# Altium project embedded-dev-26.PrjPcb
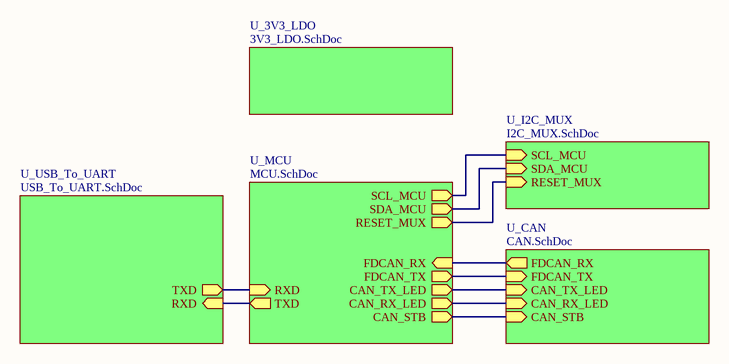
[diagram p0: TLD.SchDoc]
6 sheets, 115 parts. Net scope: hierarchical (ports join the sheet entries above them; power ports are global).
Board file: embedded-dev-26.PcbDoc
Sheets:
  TLD.SchDoc
    U_3V3_LDO = 3V3_LDO.SchDoc
    U_CAN = CAN.SchDoc
    U_I2C_MUX = I2C_MUX.SchDoc
    U_MCU = MCU.SchDoc
    U_USB_To_UART = USB_To_UART.SchDoc

## Sheet TLD.SchDoc
size A; SheetNumber: 1; SheetTotal: 5

### Sub-sheets
U_3V3_LDO = 3V3_LDO.SchDoc: no entries
U_CAN = CAN.SchDoc: FDCAN_RX (out), FDCAN_TX (in), CAN_TX_LED (in), CAN_RX_LED (in), CAN_STB (in)
U_I2C_MUX = I2C_MUX.SchDoc: SCL_MCU (in), SDA_MCU (in), RESET_MUX (in)
U_MCU = MCU.SchDoc: SCL_MCU (out), SDA_MCU (out), FDCAN_RX (in), FDCAN_TX (out), CAN_RX_LED (out), CAN_TX_LED (out), RESET_MUX (out), TXD (out), RXD (in), CAN_STB (out)
U_USB_To_UART = USB_To_UART.SchDoc: TXD (out), RXD (in)

### Nets
CAN_RX_LED: sheet U_CAN/CAN_RX_LED, sheet U_MCU/CAN_RX_LED
CAN_STB: sheet U_CAN/CAN_STB, sheet U_MCU/CAN_STB
CAN_TX_LED: sheet U_CAN/CAN_TX_LED, sheet U_MCU/CAN_TX_LED
FDCAN_RX: sheet U_CAN/FDCAN_RX, sheet U_MCU/FDCAN_RX
FDCAN_TX: sheet U_CAN/FDCAN_TX, sheet U_MCU/FDCAN_TX
RESET_MUX: sheet U_I2C_MUX/RESET_MUX, sheet U_MCU/RESET_MUX
RXD: sheet U_MCU/RXD, sheet U_USB_To_UART/TXD
SCL_MCU: sheet U_I2C_MUX/SCL_MCU, sheet U_MCU/SCL_MCU
SDA_MCU: sheet U_I2C_MUX/SDA_MCU, sheet U_MCU/SDA_MCU
TXD: sheet U_MCU/TXD, sheet U_USB_To_UART/RXD

## Sheet 3V3_LDO.SchDoc
size A; SheetNumber: 6; SheetTotal: 6
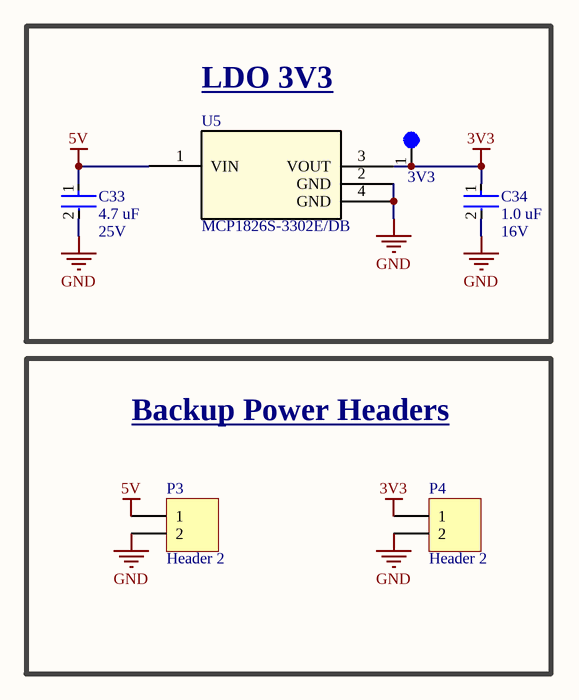
[diagram p1: 3V3_LDO.SchDoc]

### Parts
3V3  5003  [TEST-POINT-0001]  (value not drawn)
C33  Capacitance: 4.7 uF  Voltage: 25V  [CAP-0603]  (hidden comment: CC0603KRX5R8BB475)
C34  Capacitance: 1.0 uF  Voltage: 16V  [CAP-0603]  (hidden comment: CC0603KRX7R7BB105)
P3  Header 2  [HDR1X2]
P4  Header 2  [HDR1X2]
U5  MCP1826S-3302E/DB  [SOT-223_3MC_MCH]

### Blocks framed on the sheet
LDO 3V3: 3V3 C33 C34 U5
Backup Power Headers: P3 P4

### Nets
3V3: 3V3.1 C34.1 P4.1 U5.3(VOUT)
5V: C33.1 P3.1 U5.1(VIN)
GND: C33.2 C34.2 P3.2 P4.2 U5.2(GND) U5.4(GND)

### Library data of the parts
3V3 = TEST-POINT-0001: Oranange PC Test Point, Miniature Phoisphor Bronze Silver Plating Through Hole Mounting Type
C33 = CAP-4.7U-0001: CAP CER 4.7UF 25V X5R 0603; Device Class: Ceramic; Size: 0603
C34 = CAP-1U-0002: CAP CER 1UF 16V X7R 0603; Device Class: Ceramic; Size: 0603
P3 P4 = Header 2: Header, 2-Pin; LatestRevisionDate: 17-Jul-2002; LatestRevisionNote: Re-released for DXP Platform.; Publisher: Altium Limited
U5 = IC-LDO-0003: Linear Voltage Regulator IC Positive Fixed 1 Output 1A SOT-223-3; Manufacturer_Name: Microchip; Copyright: Copyright (C) 2025 Ultra Librarian. All rights reserved.; Manufacturer_Part_Number: MCP1826S-3302E/DB; RefDes: RefDes; Type: Type; ComponentLink1Description: Datasheet; ComponentLink1URL: https://ww1.microchip.com/downloads/en/DeviceDoc/22057B.pdf

## Sheet CAN.SchDoc
size A; SheetNumber: 6; SheetTotal: 6
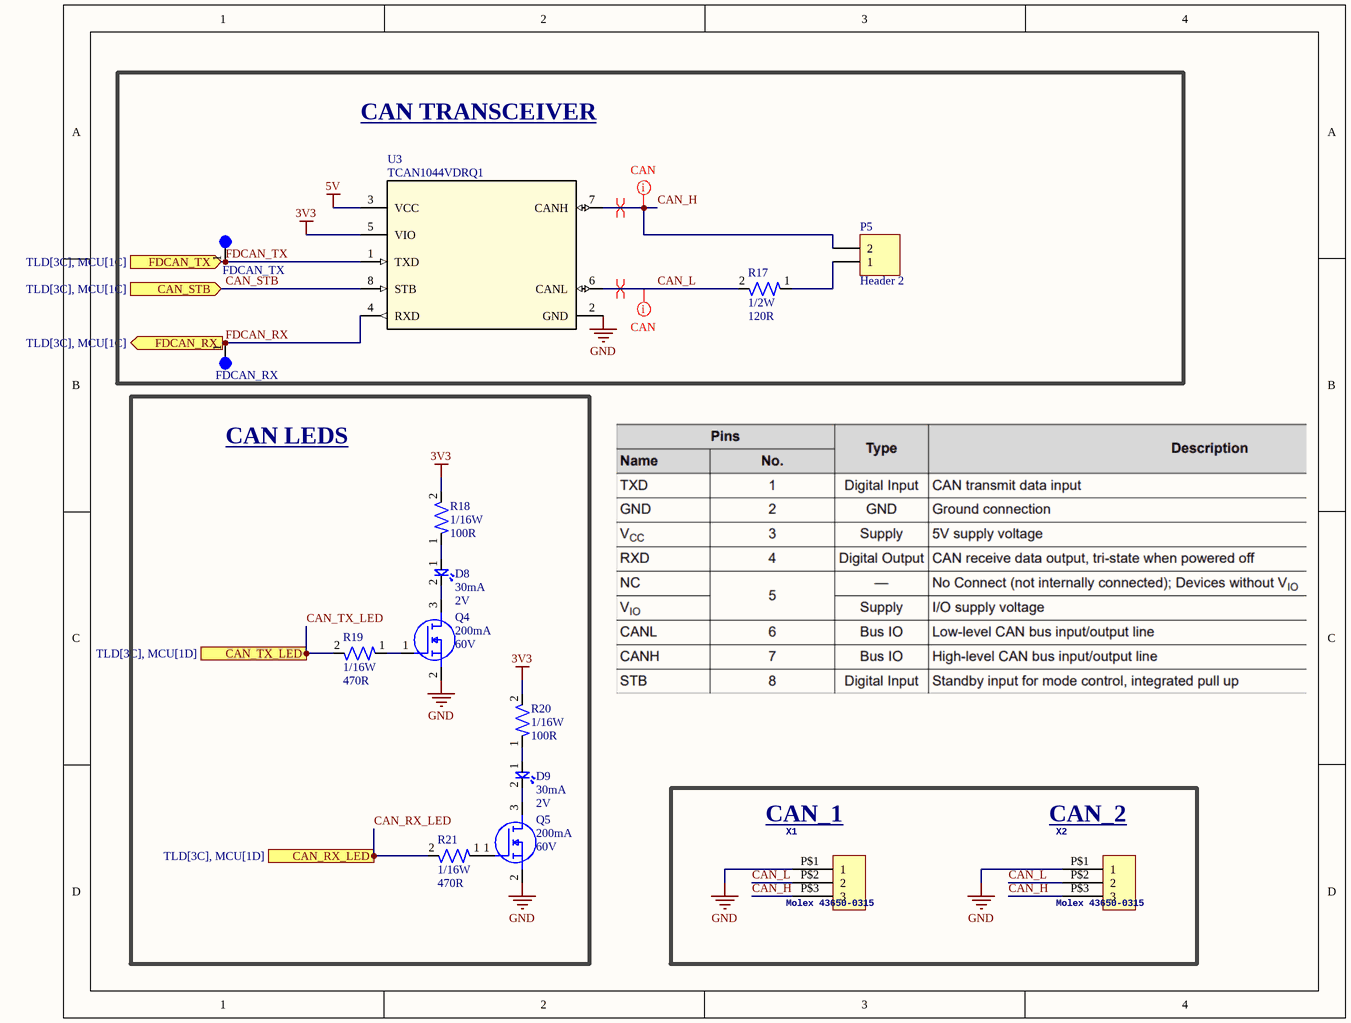
[diagram p2: CAN.SchDoc]

### Parts
D8  Forward Current: 30mA  Forward Voltage: 2V  [LED-0603]  (hidden comment: BL-HKC36G-AV-TRB)
D9  Forward Current: 30mA  Forward Voltage: 2V  [LED-0603]  (hidden comment: BL-HKC36G-AV-TRB)
FDCAN_RX  5003  [TEST-POINT-0001]  (value not drawn)
FDCAN_TX  5003  [TEST-POINT-0001]  (value not drawn)
P5  Header 2  [HDR1X2]
Q4  Continuous Current: 200mA  Voltage: 60V  [IC-SOT23-3]  (hidden comment: T2N7002AK,LM)
Q5  Continuous Current: 200mA  Voltage: 60V  [IC-SOT23-3]  (hidden comment: T2N7002AK,LM)
R17  Power: 1/2W  Resistance: 120R  [RES-1210]  (hidden comment: RC1210FR-07120RL)
R18  Power: 1/16W  Resistance: 100R  [RES-0402]  (hidden comment: RC0402FR-07100RL)
R19  Power: 1/16W  Resistance: 470R  [RES-0402]  (hidden comment: RC0402FR-07470RL)
R20  Power: 1/16W  Resistance: 100R  [RES-0402]  (hidden comment: RC0402FR-07100RL)
R21  Power: 1/16W  Resistance: 470R  [RES-0402]  (hidden comment: RC0402FR-07470RL)
U3  TCAN1044VDRQ1  [IC-8SOIC]
X1  Molex 43650-0315  [43650-0315]
X2  Molex 43650-0315  [43650-0315]

### Blocks framed on the sheet
CAN TRANSCEIVER: FDCAN_RX FDCAN_TX P5 R17 U3
CAN LEDS: D8 D9 Q4 Q5 R18-R21

### Ports
CAN_RX_LED (in, see TLD[3C], MCU[1D]), CAN_STB (in, see TLD[3C], MCU[1C]), CAN_TX_LED (in, see TLD[3C], MCU[1D]), FDCAN_RX (out, see TLD[3C], MCU[1C]), FDCAN_TX (in, see TLD[3C], MCU[1C])

### Nets
3V3: R18.2 R20.2 U3.5(VIO)
5V: U3.3(VCC)
GND: Q4.2(S) Q5.2(S) U3.2(GND) X1.P$1(1) X2.P$1(1)
CAN_H: P5.2 U3.7(CANH) X1.P$3(3) X2.P$3(3)
CAN_L: R17.2 U3.6(CANL) X1.P$2(2) X2.P$2(2)
CAN_RX_LED: R21.2 ; port CAN_RX_LED
CAN_STB: U3.8(STB) ; port CAN_STB
CAN_TX_LED: R19.2 ; port CAN_TX_LED
FDCAN_RX: FDCAN_RX.1 U3.4(RXD) ; port FDCAN_RX
FDCAN_TX: FDCAN_TX.1 U3.1(TXD) ; port FDCAN_TX
NetD8_1: D8.1 R18.1
NetD8_2: D8.2 Q4.3(D)
NetD9_1: D9.1 R20.1
NetD9_2: D9.2 Q5.3(D)
NetP5_1: P5.1 R17.1
NetQ4_1: Q4.1(G) R19.1
NetQ5_1: Q5.1(G) R21.1

### Layout directives
differential pair; differential pair class CAN: CAN_H, CAN_L
mark named CAN: CAN_H, CAN_L

### Notes on the sheet
- (near X1) CAN_1
- (near X2) CAN_2

### Library data of the parts
D8 D9 = LED-0001: LED YELLOW CLEAR 0603 SMD; ComponentLink1Description: Datasheet; ComponentLink1URL: https://www.americanbrightled.com/pdffiles/led-components/smt/BL-HKC36G-AV-TRB.pdf
FDCAN_RX FDCAN_TX = TEST-POINT-0001: as 3V3 on sheet 3V3_LDO
P5 = Header 2: Header, 2-Pin; LatestRevisionDate: 17-Jul-2002; LatestRevisionNote: Re-released for DXP Platform.; Publisher: Altium Limited
Q4 Q5 = NMOS-200MA-0001: MOSFET N-CH 60V 200MA SOT23; ComponentLink1Description: Datasheet; ComponentLink1URL: https://toshiba.semicon-storage.com/info/T2N7002AK_datasheet_en_20150401.pdf?did=29712&prodName=T2N7002AK
R17 = RES-120-0001: RES 120 OHM 1% 1/2W 1210; Tolerance: 1%; Size: 1210; ComponentLink1Description: Datasheet; ComponentLink1URL: https://www.yageo.com/upload/media/product/products/datasheet/rchip/PYu-RC_Group_51_RoHS_L_12.pdf
R18 R20 = RES-100-0001: RES 100 OHM 1% 1/16W 0402; Tolerance: 1%; Size: 0402; ComponentLink1Description: Datasheet; ComponentLink1URL: https://www.yageo.com/upload/media/product/products/datasheet/rchip/PYu-RC_Group_51_RoHS_L_12.pdf
R19 R21 = RES-470-0001: RES 470 OHM 1% 1/16W 0402; Tolerance: 1%; Size: 0402; ComponentLink1Description: Datasheet; ComponentLink1URL: https://www.yageo.com/upload/media/product/products/datasheet/rchip/PYu-RC_Group_51_RoHS_L_12.pdf
U3 = IC-CAN-0001: IC TRANSCEIVER 1/1 8SOIC; ComponentLink1Description: Datasheet; ComponentLink1URL: https://www.ti.com/lit/ds/symlink/tcan1044-q1.pdf?HQS=dis-dk-null-digikeymode-dsf-pf-null-wwe&ts=1728758303289&ref_url=https%253A%252F%252Fwww.ti.com%252Fgeneral%252Fdocs%252Fsuppproductinfo.tsp%253FdistId%253D10%2526gotoUrl%253Dhttps%253A%252F%252Fwww.ti.com%252Flit%252Fgpn%252Ftcan1044-q1
X1 X2 = Micro-Fit Molex 3 Pin Vertical: GateName_1: G$1; SymbolName_1: HEADER_POS3; DeviceSetName: HEADER_POS3_?; DeviceName: 43650-0315; LibraryName: con-molex-micro-fit-3_0_2; Package: 43650-0315

## Sheet I2C_MUX.SchDoc
size A; SheetNumber: 4; SheetTotal: 6
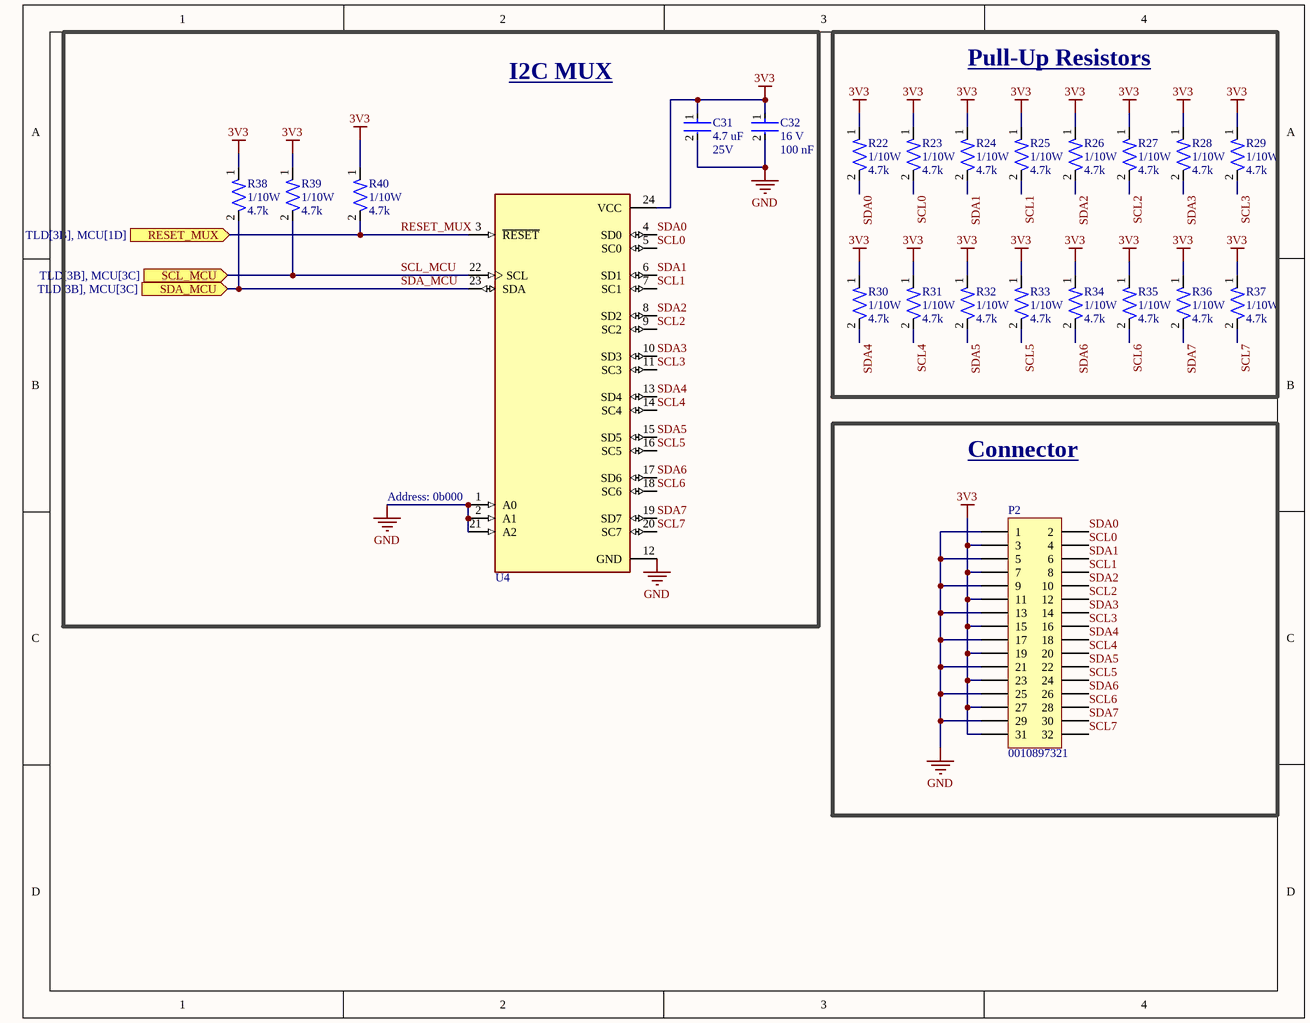
[diagram p3: I2C_MUX.SchDoc]

### Parts
C31  Capacitance: 4.7 uF  Voltage: 25V  [CAP-0603]  (hidden comment: CC0603KRX5R8BB475)
C32  Voltage Rating: 16 V  Capacitance: 100 nF  [CAP-0402]  (hidden comment: CC0402KRX7R7BB104)
P2  0010897321  [HDR2X16]
R22  Power: 1/10W  Resistance: 4.7k  [RES-0603]  (hidden comment: RC0603FR-074K7L)
R23  Power: 1/10W  Resistance: 4.7k  [RES-0603]  (hidden comment: RC0603FR-074K7L)
R24  Power: 1/10W  Resistance: 4.7k  [RES-0603]  (hidden comment: RC0603FR-074K7L)
R25  Power: 1/10W  Resistance: 4.7k  [RES-0603]  (hidden comment: RC0603FR-074K7L)
R26  Power: 1/10W  Resistance: 4.7k  [RES-0603]  (hidden comment: RC0603FR-074K7L)
R27  Power: 1/10W  Resistance: 4.7k  [RES-0603]  (hidden comment: RC0603FR-074K7L)
R28  Power: 1/10W  Resistance: 4.7k  [RES-0603]  (hidden comment: RC0603FR-074K7L)
R29  Power: 1/10W  Resistance: 4.7k  [RES-0603]  (hidden comment: RC0603FR-074K7L)
R30  Power: 1/10W  Resistance: 4.7k  [RES-0603]  (hidden comment: RC0603FR-074K7L)
R31  Power: 1/10W  Resistance: 4.7k  [RES-0603]  (hidden comment: RC0603FR-074K7L)
R32  Power: 1/10W  Resistance: 4.7k  [RES-0603]  (hidden comment: RC0603FR-074K7L)
R33  Power: 1/10W  Resistance: 4.7k  [RES-0603]  (hidden comment: RC0603FR-074K7L)
R34  Power: 1/10W  Resistance: 4.7k  [RES-0603]  (hidden comment: RC0603FR-074K7L)
R35  Power: 1/10W  Resistance: 4.7k  [RES-0603]  (hidden comment: RC0603FR-074K7L)
R36  Power: 1/10W  Resistance: 4.7k  [RES-0603]  (hidden comment: RC0603FR-074K7L)
R37  Power: 1/10W  Resistance: 4.7k  [RES-0603]  (hidden comment: RC0603FR-074K7L)
R38  Power: 1/10W  Resistance: 4.7k  [RES-0603]  (hidden comment: RC0603FR-074K7L)
R39  Power: 1/10W  Resistance: 4.7k  [RES-0603]  (hidden comment: RC0603FR-074K7L)
R40  Power: 1/10W  Resistance: 4.7k  [RES-0603]  (hidden comment: RC0603FR-074K7L)
U4  TCA9548APWR  [SOP65P640X120-24N]  (value not drawn)

### Blocks framed on the sheet
I2C MUX: C31 C32 R38-R40 U4
Pull-Up Resistors: R22-R37
Connector: P2

### Ports
RESET_MUX (in, see TLD[3B], MCU[1D]), SCL_MCU (in, see TLD[3B], MCU[3C]), SDA_MCU (in, see TLD[3B], MCU[3C])

### Nets
3V3: C31.1 C32.1 P2.3 P2.7 P2.11 P2.15 P2.19 P2.23 P2.27 P2.31 R22.1 R23.1 R24.1 R25.1 R26.1 R27.1 R28.1 R29.1 R30.1 R31.1 R32.1 R33.1 R34.1 R35.1 R36.1 R37.1 R38.1 R39.1 R40.1 U4.24(VCC)
GND: C31.2 C32.2 P2.1 P2.5 P2.9 P2.13 P2.17 P2.21 P2.25 P2.29 U4.1(A0) U4.2(A1) U4.12(GND) U4.21(A2)
RESET_MUX: R40.2 U4.3(~{RESET}) ; port RESET_MUX
SCL0: P2.4 R23.2 U4.5(SC0)
SCL1: P2.8 R25.2 U4.7(SC1)
SCL2: P2.12 R27.2 U4.9(SC2)
SCL3: P2.16 R29.2 U4.11(SC3)
SCL4: P2.20 R31.2 U4.14(SC4)
SCL5: P2.24 R33.2 U4.16(SC5)
SCL6: P2.28 R35.2 U4.18(SC6)
SCL7: P2.32 R37.2 U4.20(SC7)
SCL_MCU: R39.2 U4.22(SCL) ; port SCL_MCU
SDA0: P2.2 R22.2 U4.4(SD0)
SDA1: P2.6 R24.2 U4.6(SD1)
SDA2: P2.10 R26.2 U4.8(SD2)
SDA3: P2.14 R28.2 U4.10(SD3)
SDA4: P2.18 R30.2 U4.13(SD4)
SDA5: P2.22 R32.2 U4.15(SD5)
SDA6: P2.26 R34.2 U4.17(SD6)
SDA7: P2.30 R36.2 U4.19(SD7)
SDA_MCU: R38.2 U4.23(SDA) ; port SDA_MCU

### Notes on the sheet
- (near U4) Address: 0b000

### Library data of the parts
C31 = CAP-4.7U-0001: CAP CER 4.7UF 25V X5R 0603; Device Class: Ceramic; Size: 0603
C32 = CAP-0.1U-0001: CAP CER 0.1UF 16V X7R 0402; ComponentLink2Description: Datasheet; ComponentLink2URL: https://www.yageo.com/upload/media/product/productsearch/datasheet/mlcc/UPY-GPHC_X7R_6.3V-to-250V_24.pdf; Device Class: Ceramic; Size: 0402
P2 = Header 16X2: Header, 16-Pin, Dual row; LatestRevisionDate: 17-Jul-2002; LatestRevisionNote: Re-released for DXP Platform.; Publisher: Altium Limited
R22-R40 = RES-4.7k-0001: RES 4.7K OHM 1% 1/10W 0603; Tolerance: 1%; Size: 0603; ComponentLink1Description: Datasheet; ComponentLink1URL: https://www.yageo.com/upload/media/product/products/datasheet/rchip/PYu-RC_Group_51_RoHS_L_12.pdf
U4 = IC-MUX-0002: 8-channel 1.65- to 5.5-V I2C/SMBus switch with reset & voltage translation; MF: Texas Instruments; SnapEDA_Link: https://www.snapeda.com/parts/TCA9548APWR/Texas+Instruments/view-part/?ref=snap; Package: TSSOP-24 Texas Instruments; Value: *; MP: TCA9548APWR; Check_prices: https://www.snapeda.com/parts/TCA9548APWR/Texas+Instruments/view-part/?ref=eda; ComponentLink1Description: Datasheet; ComponentLink1URL: https://www.ti.com/general/docs/suppproductinfo.tsp?distId=10&gotoUrl=https%3A%2F%2Fwww.ti.com%2Flit%2Fgpn%2Ftca9548a

## Sheet MCU.SchDoc
size A; SheetNumber: 2; SheetTotal: 5
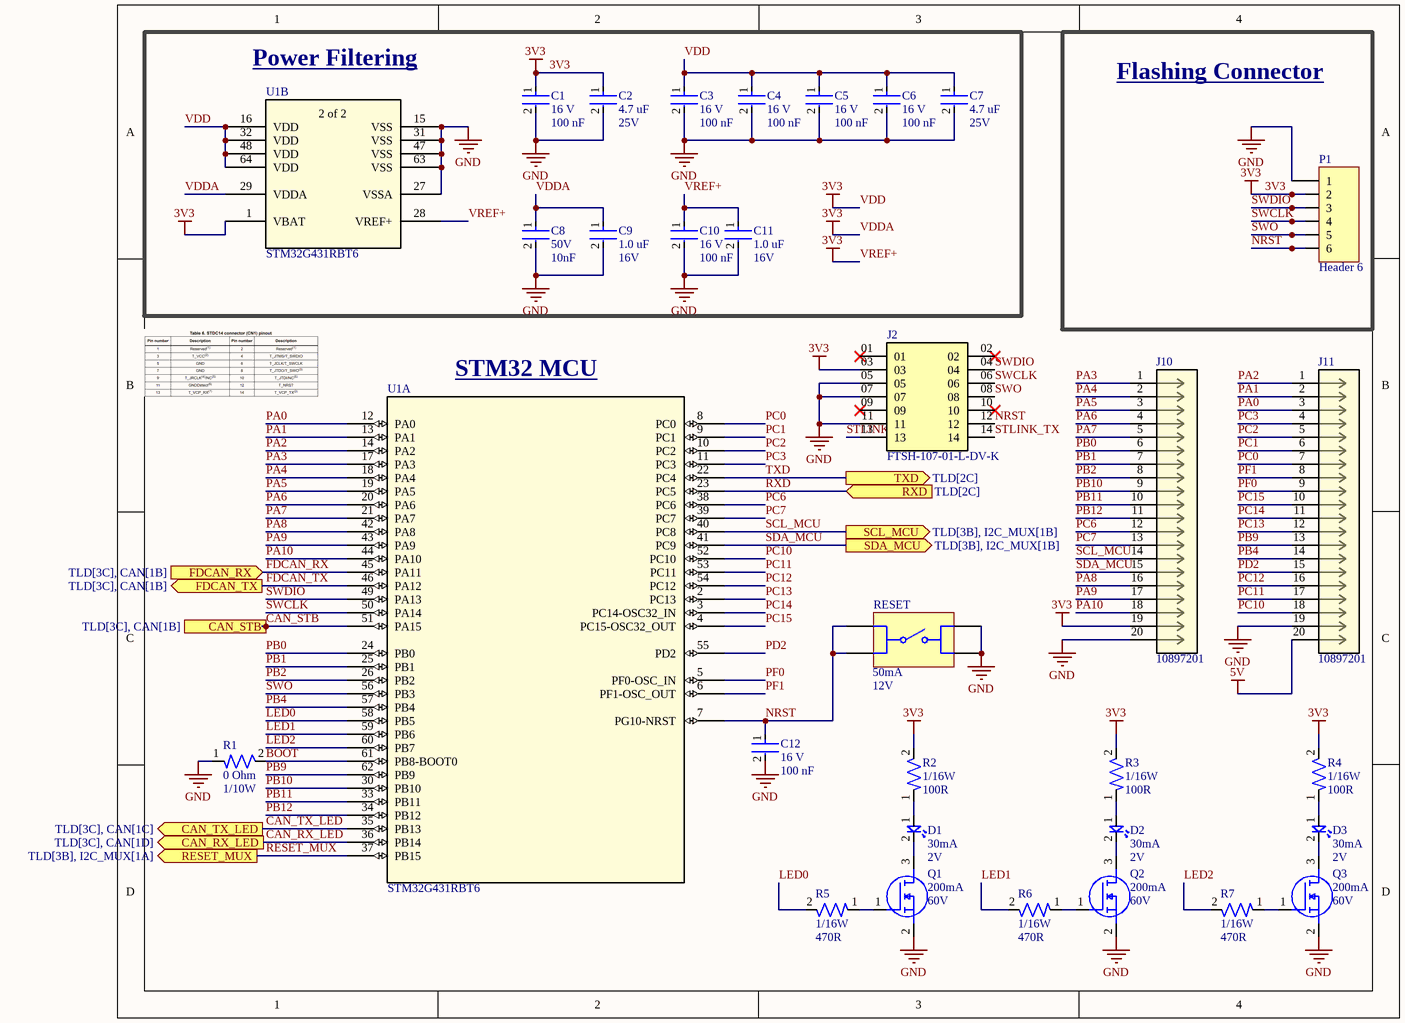
[diagram p4: MCU.SchDoc]

### Parts
C1  Voltage Rating: 16 V  Capacitance: 100 nF  [CAP-0402]  (hidden comment: CC0402KRX7R7BB104)
C2  Capacitance: 4.7 uF  Voltage: 25V  [CAP-0603]  (hidden comment: CC0603KRX5R8BB475)
C3  Voltage Rating: 16 V  Capacitance: 100 nF  [CAP-0402]  (hidden comment: CC0402KRX7R7BB104)
C4  Voltage Rating: 16 V  Capacitance: 100 nF  [CAP-0402]  (hidden comment: CC0402KRX7R7BB104)
C5  Voltage Rating: 16 V  Capacitance: 100 nF  [CAP-0402]  (hidden comment: CC0402KRX7R7BB104)
C6  Voltage Rating: 16 V  Capacitance: 100 nF  [CAP-0402]  (hidden comment: CC0402KRX7R7BB104)
C7  Capacitance: 4.7 uF  Voltage: 25V  [CAP-0603]  (hidden comment: CC0603KRX5R8BB475)
C8  Voltage: 50V  Capacitance: 10nF  [CAP-0805]  (hidden comment: GRM2195C1H103JA01D)
C9  Capacitance: 1.0 uF  Voltage: 16V  [CAP-0603]  (hidden comment: CC0603KRX7R7BB105)
C10  Voltage Rating: 16 V  Capacitance: 100 nF  [CAP-0402]  (hidden comment: CC0402KRX7R7BB104)
C11  Capacitance: 1.0 uF  Voltage: 16V  [CAP-0603]  (hidden comment: CC0603KRX7R7BB105)
C12  Voltage Rating: 16 V  Capacitance: 100 nF  [CAP-0402]  (hidden comment: CC0402KRX7R7BB104)
D1  Forward Current: 30mA  Forward Voltage: 2V  [LED-0603]  (hidden comment: BL-HKC36G-AV-TRB)
D2  Forward Current: 30mA  Forward Voltage: 2V  [LED-0603]  (hidden comment: BL-HKC36G-AV-TRB)
D3  Forward Current: 30mA  Forward Voltage: 2V  [LED-0603]  (hidden comment: BL-HKC36G-AV-TRB)
J2  FTSH-107-01-L-DV-K  [SAMTEC_FTSH-107-01-L-DV-K]
J10  10897201  [CONN20_0010897201_MOL]
J11  10897201  [CONN20_0010897201_MOL]
P1  Header 6  [HDR1X6]
Q1  Continuous Current: 200mA  Voltage: 60V  [IC-SOT23-3]  (hidden comment: T2N7002AK,LM)
Q2  Continuous Current: 200mA  Voltage: 60V  [IC-SOT23-3]  (hidden comment: T2N7002AK,LM)
Q3  Continuous Current: 200mA  Voltage: 60V  [IC-SOT23-3]  (hidden comment: T2N7002AK,LM)
R1  Resistance: 0 Ohm  Power: 1/10W  [RESC1607X60N]  (hidden comment: RESC1607X60N)
R2  Power: 1/16W  Resistance: 100R  [RES-0402]  (hidden comment: RC0402FR-07100RL)
R3  Power: 1/16W  Resistance: 100R  [RES-0402]  (hidden comment: RC0402FR-07100RL)
R4  Power: 1/16W  Resistance: 100R  [RES-0402]  (hidden comment: RC0402FR-07100RL)
R5  Power: 1/16W  Resistance: 470R  [RES-0402]  (hidden comment: RC0402FR-07470RL)
R6  Power: 1/16W  Resistance: 470R  [RES-0402]  (hidden comment: RC0402FR-07470RL)
R7  Power: 1/16W  Resistance: 470R  [RES-0402]  (hidden comment: RC0402FR-07470RL)
RESET  Rated Current: 50mA  Rated Voltage (DC): 12V  [430182095816]  (hidden comment: 430182095816)
U1  STM32G431RBT6  [LQFP64-10x10mm]  (parts A,B of 2)

### Blocks framed on the sheet
Power Filtering: C1-C11 U1
Flashing Connector: P1

### Ports
CAN_RX_LED (out, see TLD[3C], CAN[1D]), CAN_STB (out, see TLD[3C], CAN[1B]), CAN_TX_LED (out, see TLD[3C], CAN[1C]), FDCAN_RX (in, see TLD[3C], CAN[1B]), FDCAN_TX (out, see TLD[3C], CAN[1B]), RESET_MUX (out, see TLD[3B], I2C_MUX[1A]), RXD (in, see TLD[2C]), SCL_MCU (out, see TLD[3B], I2C_MUX[1B]), SDA_MCU (out, see TLD[3B], I2C_MUX[1B]), TXD (out, see TLD[2C])

### Nets
3V3: C1.1 C2.1 C3.1 C4.1 C5.1 C6.1 C7.1 C8.1 C9.1 C10.1 C11.1 J2.03 J10.19 P1.2 R2.2 R3.2 R4.2 U1.1(VBAT) U1.16(VDD) U1.28(VREF+) U1.29(VDDA) U1.32(VDD) U1.48(VDD) U1.64(VDD)  [also labelled VDD, VDDA, VREF+]
5V: J11.20
GND: C1.2 C2.2 C3.2 C4.2 C5.2 C6.2 C7.2 C8.2 C9.2 C10.2 C11.2 C12.2 J2.05 J2.07 J2.11 J10.20 J11.19 P1.1 Q1.2(S) Q2.2(S) Q3.2(S) R1.1 RESET.B1 RESET.B2 U1.15(VSS) U1.27(VSSA) U1.31(VSS) U1.47(VSS) U1.63(VSS)
BOOT: R1.2 U1.61(PB8-BOOT0)
CAN_RX_LED: U1.36(PB14) ; port CAN_RX_LED
CAN_STB: U1.51(PA15) ; port CAN_STB
CAN_TX_LED: U1.35(PB13) ; port CAN_TX_LED
FDCAN_RX: U1.45(PA11) ; port FDCAN_RX
FDCAN_TX: U1.46(PA12) ; port FDCAN_TX
LED0: R5.2 U1.58(PB5)
LED1: R6.2 U1.59(PB6)
LED2: R7.2 U1.60(PB7)
NRST: C12.1 J2.12 P1.6 RESET.A1 RESET.A2 U1.7(PG10-NRST)
PA0: J11.3 U1.12(PA0)
PA1: J11.2 U1.13(PA1)
PA2: J11.1 U1.14(PA2)
PA3: J10.1 U1.17(PA3)
PA4: J10.2 U1.18(PA4)
PA5: J10.3 U1.19(PA5)
PA6: J10.4 U1.20(PA6)
PA7: J10.5 U1.21(PA7)
PA8: J10.16 U1.42(PA8)
PA9: J10.17 U1.43(PA9)
PA10: J10.18 U1.44(PA10)
PB0: J10.6 U1.24(PB0)
PB1: J10.7 U1.25(PB1)
PB2: J10.8 U1.26(PB2)
PB4: J11.14 U1.57(PB4)
PB9: J11.13 U1.62(PB9)
PB10: J10.9 U1.30(PB10)
PB11: J10.10 U1.33(PB11)
PB12: J10.11 U1.34(PB12)
PC0: J11.7 U1.8(PC0)
PC1: J11.6 U1.9(PC1)
PC2: J11.5 U1.10(PC2)
PC3: J11.4 U1.11(PC3)
PC6: J10.12 U1.38(PC6)
PC7: J10.13 U1.39(PC7)
PC10: J11.18 U1.52(PC10)
PC11: J11.17 U1.53(PC11)
PC12: J11.16 U1.54(PC12)
PC13: J11.12 U1.2(PC13)
PC14: J11.11 U1.3(PC14-OSC32_IN)
PC15: J11.10 U1.4(PC15-OSC32_OUT)
PD2: J11.15 U1.55(PD2)
PF0: J11.9 U1.5(PF0-OSC_IN)
PF1: J11.8 U1.6(PF1-OSC_OUT)
RESET_MUX: U1.37(PB15) ; port RESET_MUX
RXD: U1.23(PC5) ; port RXD
SCL_MCU: J10.14 U1.40(PC8) ; port SCL_MCU
SDA_MCU: J10.15 U1.41(PC9) ; port SDA_MCU
STLINK_RX: J2.13
STLINK_TX: J2.14
SWCLK: J2.06 P1.4 U1.50(PA14)
SWDIO: J2.04 P1.3 U1.49(PA13)
SWO: J2.08 P1.5 U1.56(PB3)
TXD: U1.22(PC4) ; port TXD
NetD1_1: D1.1 R2.1
NetD1_2: D1.2 Q1.3(D)
NetD2_1: D2.1 R3.1
NetD2_2: D2.2 Q2.3(D)
NetD3_1: D3.1 R4.1
NetD3_2: D3.2 Q3.3(D)
NetQ1_1: Q1.1(G) R5.1
NetQ2_1: Q2.1(G) R6.1
NetQ3_1: Q3.1(G) R7.1

Not connected (* = marked no-connect by the designer): J2 01* 02* 09* 10*

### Notes on the sheet
- (near U1) STM32 MCU
- (in symbol IC-STM32G431RBT6, part B) 2 of 2

### Library data of the parts
C1 C3-C6 C10 C12 = CAP-0.1U-0001: CAP CER 0.1UF 16V X7R 0402; ComponentLink2Description: Datasheet; ComponentLink2URL: https://www.yageo.com/upload/media/product/productsearch/datasheet/mlcc/UPY-GPHC_X7R_6.3V-to-250V_24.pdf; Device Class: Ceramic; Size: 0402
C2 C7 = CAP-4.7U-0001: CAP CER 4.7UF 25V X5R 0603; Device Class: Ceramic; Size: 0603
C8 = CAP-10N-0001: CAP CER 10000PF 50V C0G/NP0 0805; Device Class: Ceramic; Size: 0805; ComponentLink1Description: Datasheet; ComponentLink1URL: https://search.murata.co.jp/Ceramy/image/img/A01X/G101/ENG/GRM2195C1H103JA01-01.pdf
C9 C11 = CAP-1U-0002: CAP CER 1UF 16V X7R 0603; Device Class: Ceramic; Size: 0603
D1-D3 = LED-0001: LED YELLOW CLEAR 0603 SMD; ComponentLink1Description: Datasheet; ComponentLink1URL: https://www.americanbrightled.com/pdffiles/led-components/smt/BL-HKC36G-AV-TRB.pdf
J2 = CONN_Flashing-0001: Connector Header Surface Mount 14 position 0.050" (1.27mm); MF: Samtec; Value: *; Price: None; Package: None; Availability: Unavailable; MP: FTSH-107-01-L-DV-K; ComponentLink1Description: Datasheet; ComponentLink1URL: https://mm.digikey.com/Volume0/opasdata/d220001/medias/docus/6209/ftsh-1xx-xx-xxx-dv-xxx-xxx-x-xx-mkt.pdf
J10 J11 = CONN-20: 2.54mm Pitch C-Grid Breakaway Header, Dual Row, Vertical, High Temperature, 20 Circuits, Tin (Sn) Plating, 2.72mm PC Tail Length; Manufacturer_Name: Molex Connector Corporation; Copyright: Copyright (C) 2025 Ultra Librarian. All rights reserved.; Manufacturer_Part_Number: 10897201; Datasheet: https://www.molex.com/en-us/products/part-detail-pdf/10897201?display=pdf; RefDes: RefDes; Type: Type
P1 = Header 6: Header, 6-Pin; LatestRevisionDate: 17-Jul-2002; LatestRevisionNote: Re-released for DXP Platform.; Publisher: Altium Limited
Q1-Q3 = NMOS-200MA-0001: MOSFET N-CH 60V 200MA SOT23; ComponentLink1Description: Datasheet; ComponentLink1URL: https://toshiba.semicon-storage.com/info/T2N7002AK_datasheet_en_20150401.pdf?did=29712&prodName=T2N7002AK
R1 = RES-0-0003: 0 Ohms Jumper Chip Resistor 0603 (1608 Metric) Moisture Resistant Thick Film; assembled?: yes; JLC part number: C106231
R2-R4 = RES-100-0001: RES 100 OHM 1% 1/16W 0402; Tolerance: 1%; Size: 0402; ComponentLink1Description: Datasheet; ComponentLink1URL: https://www.yageo.com/upload/media/product/products/datasheet/rchip/PYu-RC_Group_51_RoHS_L_12.pdf
R5-R7 = RES-470-0001: RES 470 OHM 1% 1/16W 0402; Tolerance: 1%; Size: 0402; ComponentLink1Description: Datasheet; ComponentLink1URL: https://www.yageo.com/upload/media/product/products/datasheet/rchip/PYu-RC_Group_51_RoHS_L_12.pdf
RESET = BUTTON-VERT-12V-0.5A: WS-TASV SMT Tact Switch, 6mm x 6mm, 160gf, SPST-NO, 12V, 50mA; Manufacturer: Wurth Elektronik; Washable: No; Manufacturer Part Number: 430182095816; Category: Tact Switch; Match Code: WS-TASV; ComponentLink1Description: Website Link; ComponentLink1URL: https://www.we-online.com/redexpert/article/430182095816?ad; ComponentLink2Description: Datasheet Link; ComponentLink2URL: https://www.we-online.com/redexpert/spec/430182095816?ad; Mount: Surface Mount; Min Operating Temperature: -40°C; Max Operating Temperature: 85°C; Packaging: Tape and Reel; Length: 6mm; Width: 6mm; Height: 9.5mm; Circuit: SPST-NO; Contact Material: Stainless Steel; Contact Plating: Silver; Operation Force: 160gf; Terminal Material: Copper Alloy; Terminal Plating: Silver
U1 = IC-STM32G431RBT6: Mainstream Arm Cortex-M4 MCU 170 MHz with 128 Kbytes of Flash memory, Math Accelerator, Medium Analog level integration; Manufacturer_Name: STMicroelectronics; Copyright: Copyright (C) 2025 Ultra Librarian. All rights reserved.; Manufacturer_Part_Number: STM32G431RBT6; Datasheet: https://www.st.com/resource/en/datasheet/stm32g431c6.pdf; RefDes: RefDes; Type: Type

## Sheet USB_To_UART.SchDoc
size A; SheetNumber: 3; SheetTotal: 5
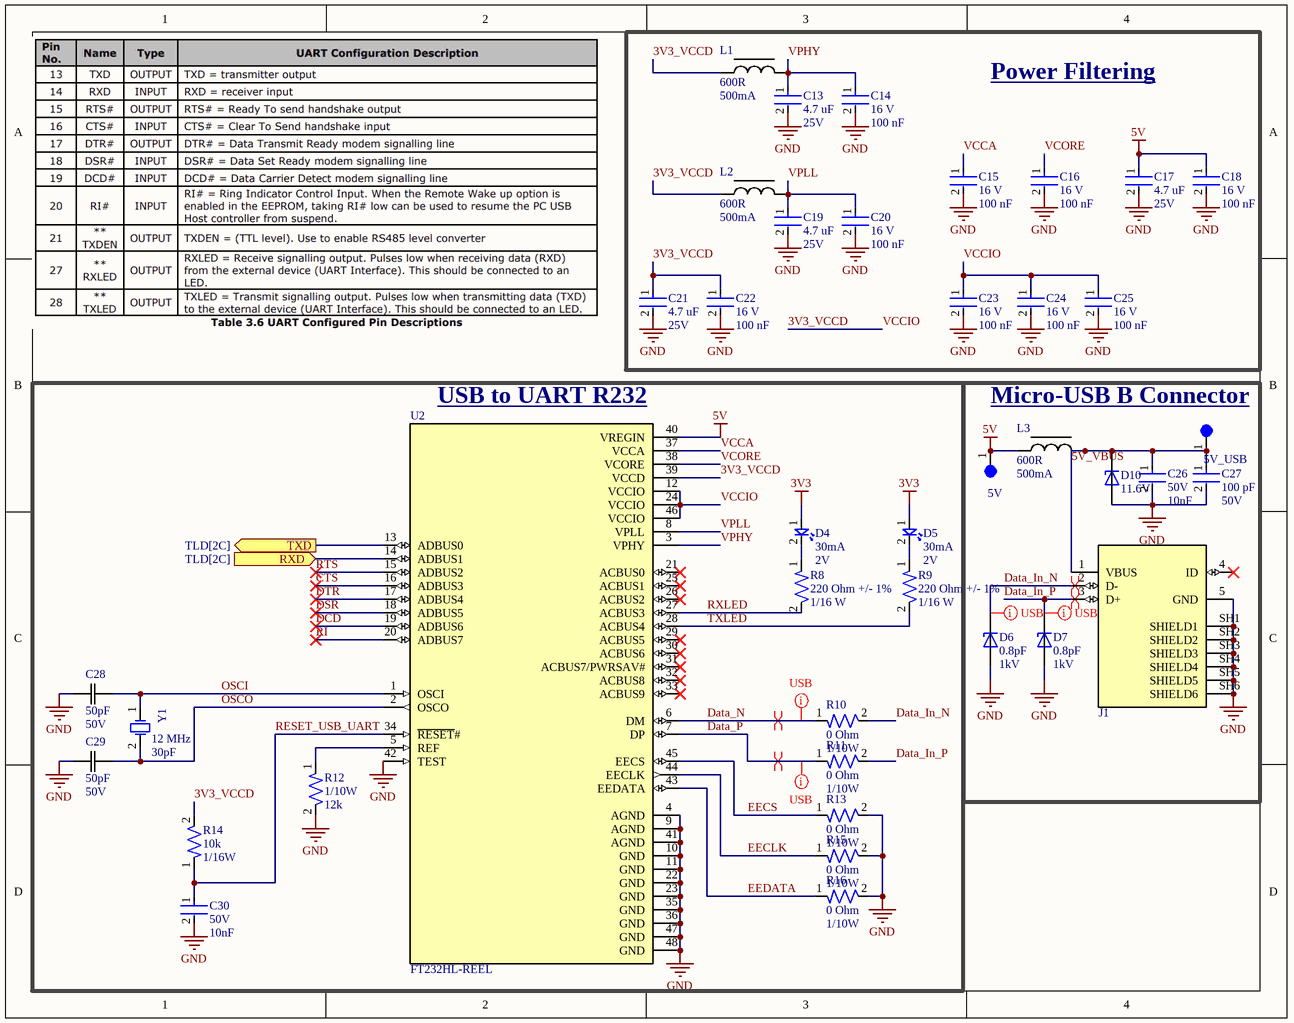
[diagram p5: USB_To_UART.SchDoc]

### Parts
5V  5003  [TEST-POINT-0001]  (value not drawn)
5V_USB  5003  [TEST-POINT-0001]  (value not drawn)
C13  Capacitance: 4.7 uF  Voltage: 25V  [CAP-0603]  (hidden comment: CC0603KRX5R8BB475)
C14  Voltage Rating: 16 V  Capacitance: 100 nF  [CAP-0402]  (hidden comment: CC0402KRX7R7BB104)
C15  Voltage Rating: 16 V  Capacitance: 100 nF  [CAP-0402]  (hidden comment: CC0402KRX7R7BB104)
C16  Voltage Rating: 16 V  Capacitance: 100 nF  [CAP-0402]  (hidden comment: CC0402KRX7R7BB104)
C17  Capacitance: 4.7 uF  Voltage: 25V  [CAP-0603]  (hidden comment: CC0603KRX5R8BB475)
C18  Voltage Rating: 16 V  Capacitance: 100 nF  [CAP-0402]  (hidden comment: CC0402KRX7R7BB104)
C19  Capacitance: 4.7 uF  Voltage: 25V  [CAP-0603]  (hidden comment: CC0603KRX5R8BB475)
C20  Voltage Rating: 16 V  Capacitance: 100 nF  [CAP-0402]  (hidden comment: CC0402KRX7R7BB104)
C21  Capacitance: 4.7 uF  Voltage: 25V  [CAP-0603]  (hidden comment: CC0603KRX5R8BB475)
C22  Voltage Rating: 16 V  Capacitance: 100 nF  [CAP-0402]  (hidden comment: CC0402KRX7R7BB104)
C23  Voltage Rating: 16 V  Capacitance: 100 nF  [CAP-0402]  (hidden comment: CC0402KRX7R7BB104)
C24  Voltage Rating: 16 V  Capacitance: 100 nF  [CAP-0402]  (hidden comment: CC0402KRX7R7BB104)
C25  Voltage Rating: 16 V  Capacitance: 100 nF  [CAP-0402]  (hidden comment: CC0402KRX7R7BB104)
C26  Voltage: 50V  Capacitance: 10nF  [CAP-0805]  (hidden comment: GRM2195C1H103JA01D)
C27  Capacitance: 100 pF  Voltage: 50V  [CAP-0402]  (hidden comment: CC0402JRNPO9BN101)
C28  Capacitance: 50pF  Voltage: 50V  [CAP_CC0402_YAG]  (hidden comment: CC0402JRNPO9BN500)
C29  Capacitance: 50pF  Voltage: 50V  [CAP_CC0402_YAG]  (hidden comment: CC0402JRNPO9BN500)
C30  Voltage: 50V  Capacitance: 10nF  [CAP-0805]  (hidden comment: GRM2195C1H103JA01D)
D4  Forward Current: 30mA  Forward Voltage: 2V  [LED-0603]  (hidden comment: BL-HKC36G-AV-TRB)
D5  Forward Current: 30mA  Forward Voltage: 2V  [LED-0603]  (hidden comment: BL-HKC36G-AV-TRB)
D6  Capacitance: 0.8pF  Voltage: 1kV  [TVS_ESD321DPYR]  (hidden comment: ESD321DPYR)
D7  Capacitance: 0.8pF  Voltage: 1kV  [TVS_ESD321DPYR]  (hidden comment: ESD321DPYR)
D10  Voltage: 11.6V  [TVS_ESDA7P60-1U1M]  (hidden comment: ESDA7P60-1U1M)
J1  1050170001  [MOLEX_1050170001]  (value not drawn)
L1  Resistance: 600R  Current: 500mA  [FILTER_BLM18AG_MUR-L]  (hidden comment: BLM18AG601SN1D)
L2  Resistance: 600R  Current: 500mA  [FILTER_BLM18AG_MUR-L]  (hidden comment: BLM18AG601SN1D)
L3  Resistance: 600R  Current: 500mA  [FILTER_BLM18AG_MUR-L]  (hidden comment: BLM18AG601SN1D)
R8  Resistance: 220 Ohm +/- 1%  Power: 1/16 W  [RES-0402]  (hidden comment: RM04FTN2200)
R9  Resistance: 220 Ohm +/- 1%  Power: 1/16 W  [RES-0402]  (hidden comment: RM04FTN2200)
R10  Resistance: 0 Ohm  Power: 1/10W  [RESC1607X60N]  (hidden comment: RESC1607X60N)
R11  Resistance: 0 Ohm  Power: 1/10W  [RESC1607X60N]  (hidden comment: RESC1607X60N)
R12  Power: 1/10W  Resistance: 12k  [RES-0603]  (hidden comment: RC0603FR-0712KL)
R13  Resistance: 0 Ohm  Power: 1/10W  [RESC1607X60N]  (hidden comment: RESC1607X60N)
R14  Resistance: 10k  Power: 1/16W  [RES-0402]  (hidden comment: RC0402FR-0710KL)
R15  Resistance: 0 Ohm  Power: 1/10W  [RESC1607X60N]  (hidden comment: RESC1607X60N)
R16  Resistance: 0 Ohm  Power: 1/10W  [RESC1607X60N]  (hidden comment: RESC1607X60N)
U2  FT232HL-REEL  [QFP50P900X900X160-48N]
Y1  Frequency: 12 MHz  Load Capacitance: 30pF  [WE-XTAL_HC49/4HSMX]  (hidden comment: 830010043)

### Blocks framed on the sheet
Power Filtering: C13-C25 L1 L2
USB to UART R232: C28-C30 D4 D5 R8-R16 U2 Y1
Micro-USB B Connector: 5V 5V_USB C26 C27 D6 D7 D10 J1 L3

### Ports
RXD (in, see TLD[2C]), TXD (out, see TLD[2C])

### Nets
3V3: D4.1 D5.1
5V: 5V.1 C17.1 C18.1 L3.1 U2.40(VREGIN)
GND: C13.2 C14.2 C15.2 C16.2 C17.2 C18.2 C19.2 C20.2 C21.2 C22.2 C23.2 C24.2 C25.2 C26.2 C27.2 C28.1 C29.1 C30.2 D6.2 D7.2 D10.2 J1.5(GND) J1.SH1(SHIELD1) J1.SH2(SHIELD2) J1.SH3(SHIELD3) J1.SH4(SHIELD4) J1.SH5(SHIELD5) J1.SH6(SHIELD6) R12.2 R13.2 R15.2 R16.2 U2.4(AGND) U2.9(AGND) U2.10(GND) U2.11(GND) U2.22(GND) U2.23(GND) U2.35(GND) U2.36(GND) U2.41(AGND) U2.42(TEST) U2.47(GND) U2.48(GND)
3V3_VCCD: C21.1 C22.1 C23.1 C24.1 C25.1 L1.1 L2.1 R14.2 U2.12(VCCIO) U2.24(VCCIO) U2.39(VCCD) U2.46(VCCIO)  [also labelled VCCIO]
5V_VBUS: 5V_USB.1 C26.1 C27.1 D10.1 J1.1(VBUS) L3.2
CTS: U2.16(ADBUS3)
Data_In_N: D6.1 J1.2(D-) R10.2
Data_In_P: D7.1 J1.3(D+) R11.2
Data_N: R10.1 U2.6(DM)
Data_P: R11.1 U2.7(DP)
DCD: U2.19(ADBUS6)
DSR: U2.18(ADBUS5)
DTR: U2.17(ADBUS4)
EECLK: R15.1 U2.44(EECLK)
EECS: R13.1 U2.45(EECS)
EEDATA: R16.1 U2.43(EEDATA)
OSCI: C28.2 U2.1(OSCI) Y1.1(OSC1)
OSCO: C29.2 U2.2(OSCO) Y1.2(OSC2)
RESET_USB_UART: C30.1 R14.1 U2.34(~{RESET}#)
RI: U2.20(ADBUS7)
RTS: U2.15(ADBUS2)
RXD: U2.13(ADBUS0) ; port TXD
RXLED: R8.2 U2.27(ACBUS3)
TXD: U2.14(ADBUS1) ; port RXD
TXLED: R9.2 U2.28(ACBUS4)
VCCA: C15.1 U2.37(VCCA)
VCORE: C16.1 U2.38(VCORE)
VPHY: C13.1 C14.1 L1.2 U2.3(VPHY)
VPLL: C19.1 C20.1 L2.2 U2.8(VPLL)
NetD4_2: D4.2 R8.1
NetD5_2: D5.2 R9.1
NetR12_1: R12.1 U2.5(REF)

Not connected (* = marked no-connect by the designer): J1 4(ID)*; U2 21(ACBUS0)* 25(ACBUS1)* 26(ACBUS2)* 29(ACBUS5)* 30(ACBUS6)* 31(ACBUS7/PWRSAV#)* 32(ACBUS8)* 33(ACBUS9)*

### Layout directives
differential pair; differential pair class USB: Data_In_N, Data_In_P, Data_N, Data_P
mark named USB: Data_In_N, Data_In_P, Data_N, Data_P

### Library data of the parts
5V 5V_USB = TEST-POINT-0001: as 3V3 on sheet 3V3_LDO
C13 C17 C19 C21 = CAP-4.7U-0001: CAP CER 4.7UF 25V X5R 0603; Device Class: Ceramic; Size: 0603
C14-C16 C18 C20 C22-C25 = CAP-0.1U-0001: CAP CER 0.1UF 16V X7R 0402; ComponentLink2Description: Datasheet; ComponentLink2URL: https://www.yageo.com/upload/media/product/productsearch/datasheet/mlcc/UPY-GPHC_X7R_6.3V-to-250V_24.pdf; Device Class: Ceramic; Size: 0402
C26 C30 = CAP-10N-0001: CAP CER 10000PF 50V C0G/NP0 0805; Device Class: Ceramic; Size: 0805; ComponentLink1Description: Datasheet; ComponentLink1URL: https://search.murata.co.jp/Ceramy/image/img/A01X/G101/ENG/GRM2195C1H103JA01-01.pdf
C27 = CAP-100P-0001: CAP CER 100PF 50V C0G/NPO 0402; Device Class: Ceramic; Size: 0402; ComponentLink1Description: Datasheet; ComponentLink1URL: https://www.yageo.com/upload/media/product/productsearch/datasheet/mlcc/UPY-GP_NP0_16V-to-50V_18.pdf
C28 C29 = CAP-50p: 50 pF ±5% 50V Ceramic Capacitor C0G, NP0 0402 (1005 Metric); Manufacturer_Name: Yageo; Copyright: Copyright (C) 2025 Ultra Librarian. All rights reserved.; Manufacturer_Part_Number: CC0402JRNPO9BN500; ComponentLink1Description: Datasheet; ComponentLink1URL: https://www.yageo.com/en/Chart/Download/pdf/CC0402JRNPO9BN500
D4 D5 = LED-0001: LED YELLOW CLEAR 0603 SMD; ComponentLink1Description: Datasheet; ComponentLink1URL: https://www.americanbrightled.com/pdffiles/led-components/smt/BL-HKC36G-AV-TRB.pdf
D6 D7 = DIO-TVS-0004: 0.8-pF 3.3-V Â±30-kV ESD protection diode with 6.8-V 16-A TLP clamping in 0402 package for USB 2.0; MF: Texas Instruments; SnapEDA_Link: https://www.snapeda.com/parts/ESD321DPYR/Texas+Instruments/view-part/?ref=snap; Package: X1SON-2 Texas Instruments; Value: *; MP: ESD321DPYR; Check_prices: https://www.snapeda.com/parts/ESD321DPYR/Texas+Instruments/view-part/?ref=eda; ComponentLink1Description: Datasheet; ComponentLink1URL: https://www.ti.com/general/docs/suppproductinfo.tsp?distId=10&gotoUrl=https%3A%2F%2Fwww.ti.com%2Flit%2Fgpn%2Fesd321
D10 = DIO-TVS-11V: TVS DIODE 5VWM 11.6VC 1610; MF: {'manufacturer': u'STMicroelectronics'}; Package: None; Price: None; Value: *; MP: ESDA7P60-1U1M; Availability: Unavailable; ComponentLink1Description: Datasheet; ComponentLink1URL: https://www.st.com/resource/en/datasheet/esda20p50-1u1m.pdf
J1 = CONN-Micro-USB-B-0001: USB - micro B USB 2.0 Receptacle Connector 5 Position Surface Mount, Right Angle; Through Hole; MF: Molex; SnapEDA_Link: https://www.snapeda.com/parts/1050170001/Molex/view-part/?ref=snap; Package: None; Value: *; MP: 1050170001; Check_prices: https://www.snapeda.com/parts/1050170001/Molex/view-part/?ref=eda; ComponentLink1Description: Datasheet; ComponentLink1URL: https://www.molex.com/pdm_docs/sd/1050170001_sd.pdf
L1-L3 = FBEAD-600R-0.5A: 600 Ohms @ 100 MHz 1 Ferrite Bead 0603 (1608 Metric) 500mA 380mOhm; Manufacturer_Name: Murata; Copyright: Copyright (C) 2025 Ultra Librarian. All rights reserved.; Manufacturer_Part_Number: BLM18AG601SN1D; ComponentLink1Description: Datasheet; ComponentLink1URL: https://www.murata.com/en-us/products/productdata/8796738650142/ENFA0003.pdf
R8 R9 = RES-220-0002-JLC: 62.5mW Thick Film Resistors 50V ±100ppm/℃ ±1% -55℃~+155℃ 220Ω 0402  Chip Resistor - Surface Mount ROHS; assembled?: yes; JLC part number: C160487
R10 R11 R13 R15 R16 = RES-0-0003: as R1 on sheet MCU; JLC part number: C106231
R12 = RES-12k-0001: RES 12K OHM 1% 1/10W 0603; Tolerance: 1%; Size: 0603; ComponentLink1Description: Datasheet; ComponentLink1URL: https://www.lcsc.com/datasheet/lcsc_datasheet_2304140030_YAGEO-RC0603FR-0712KL_C114659.pdf
R14 = RES-10k-0001: RES 10K OHM 1% 1/16W 0402; Tolerance: 1%; Size: 0402; ComponentLink1Description: Datasheet; ComponentLink1URL: https://www.yageo.com/upload/media/product/products/datasheet/rchip/PYu-RC_Group_51_RoHS_L_12.pdf
U2 = IC-USB-TO_UART: Ic, Interface; Usb Hi-Speed To Uart/Fifo/Spi/Jtag, I2c; 1.8v-5.25v; 25ma; Lqfp-48; MF: FTDI, Future; Package: LQFP-48 FTDI; Price: None; Check_prices: https://www.snapeda.com/parts/FT232HL-REEL/FTDI%252C+Future+Technology+Devices+International+Ltd/view-part/?ref=eda; Value: *; SnapEDA_Link: https://www.snapeda.com/parts/FT232HL-REEL/FTDI%252C+Future+Technology+Devices+International+Ltd/view-part/?ref=snap; MP: FT232HL-REEL; Availability: In Stock; Purchase-URL: https://pricing.snapeda.com/search/part/FT232HL-REEL/?ref=eda; ComponentLink1Description: Datasheet; ComponentLink1URL: https://ftdichip.com/wp-content/uploads/2023/09/DS_FT232H.pdf
Y1 = CRYSTAL-12MHz-30pF: WE-XTAL Quartz Crystal, SMT, HC49/4HSMX, 12 MHz, ±30ppm; Manufacturer: Wurth Elektronik; Frequency Stability: 50ppm; Manufacturer Part Number: 830010043; Category: Crystals; Match Code: WE-XTAL; ComponentLink1Description: Website Link; ComponentLink1URL: https://www.we-online.com/redexpert/article/830010043?ad; ComponentLink2Description: Datasheet Link; ComponentLink2URL: https://www.we-online.com/redexpert/spec/830010043?ad; Mount: Surface Mount; Min Operating Temperature: -10°C; Max Operating Temperature: 60°C; Packaging: Tape and Reel; Case/Size Code: HC49/4HSMX; Length: 12.4mm; Width: 4.7mm; Height: 4.5mm; Application: Processor, USB, CAN; Frequency Tolerance: ±30ppm

## Nets that join several sheets
3V3: 3V3_LDO (3V3.1 C34.1 P4.1 U5.3), CAN (R18.2 R20.2 U3.5), I2C_MUX (30 pins), MCU (24 pins), USB_To_UART (D4.1 D5.1)
5V: 3V3_LDO (C33.1 P3.1 U5.1), CAN (U3.3), MCU (J11.20), USB_To_UART (5 pins)
GND: 3V3_LDO (6 pins), CAN (5 pins), I2C_MUX (14 pins), MCU (29 pins), USB_To_UART (44 pins)
CAN_RX_LED: CAN (R21.2), MCU (U1.36)
CAN_STB: CAN (U3.8), MCU (U1.51)
CAN_TX_LED: CAN (R19.2), MCU (U1.35)
FDCAN_RX: CAN (FDCAN_RX.1 U3.4), MCU (U1.45)
FDCAN_TX: CAN (FDCAN_TX.1 U3.1), MCU (U1.46)
RESET_MUX: I2C_MUX (R40.2 U4.3), MCU (U1.37)
RXD: MCU (U1.23), USB_To_UART (U2.13)
SCL_MCU: I2C_MUX (R39.2 U4.22), MCU (J10.14 U1.40)
SDA_MCU: I2C_MUX (R38.2 U4.23), MCU (J10.15 U1.41)
TXD: MCU (U1.22), USB_To_UART (U2.14)